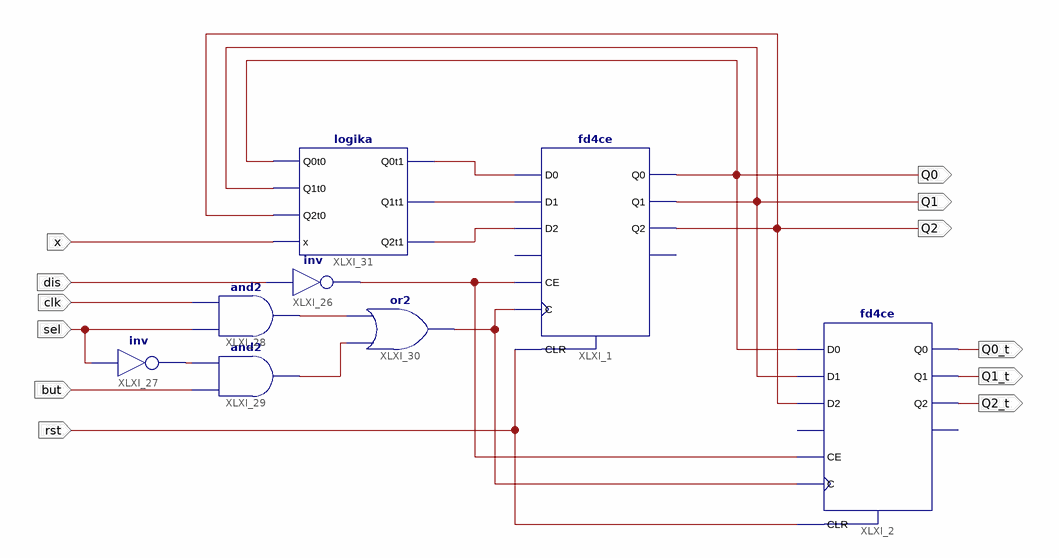
[diagram p0: schematic sheet 1]
// Xilinx ISE schematic automat.sch (spartan3e) as structural Verilog: 8 symbols, 12 ports
module automat (
  input  x,
  input  rst,
  input  dis,
  input  sel,
  input  but,
  input  clk,
  output Q0_t,
  output Q1_t,
  output Q2_t,
  output Q1,
  output Q2,
  output Q0
);

  wire XLXN_149, XLXN_152, XLXN_154, XLXN_155, XLXN_161, XLXN_162, XLXN_163, XLXN_164;

  fd4ce XLXI_1 (
    .C(XLXN_161), .CE(XLXN_149), .CLR(rst), .D0(XLXN_164), .D1(XLXN_163), .D2(XLXN_162), .Q0(Q0), .Q1(Q1),
    .Q2(Q2));  // open: D3, Q3
  fd4ce XLXI_2 (
    .C(XLXN_161), .CE(XLXN_149), .CLR(rst), .D0(Q0), .D1(Q1), .D2(Q2), .Q0(Q0_t), .Q1(Q1_t), .Q2(Q2_t));  // open: D3, Q3
  and XLXI_29 (XLXN_155, but, XLXN_152);
  or XLXI_30 (XLXN_161, XLXN_155, XLXN_154);
  not XLXI_26 (XLXN_149, dis);
  and XLXI_28 (XLXN_154, sel, clk);
  not XLXI_27 (XLXN_152, sel);
  logika XLXI_31 (.x(x), .Q0t0(Q0), .Q1t0(Q1), .Q2t0(Q2), .Q1t1(XLXN_163), .Q0t1(XLXN_164), .Q2t1(XLXN_162));
endmodule
